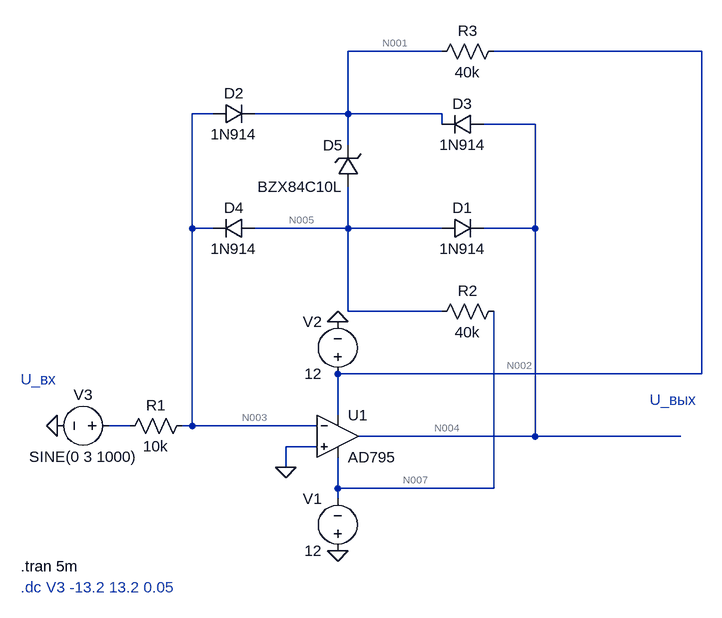
[diagram p0: schematic s3.asc]
s3.asc, the LTspice schematic file:
Version 4.1
SHEET 1 932 680
WIRE 304 -432 160 -432
WIRE 704 -432 384 -432
WIRE -48 -336 -80 -336
WIRE 160 -336 160 -432
WIRE 160 -336 16 -336
WIRE 304 -336 160 -336
WIRE 304 -320 304 -336
WIRE 448 -320 368 -320
WIRE 160 -288 160 -336
WIRE -80 -160 -80 -336
WIRE -48 -160 -80 -160
WIRE 160 -160 160 -224
WIRE 160 -160 16 -160
WIRE 304 -160 160 -160
WIRE 448 -160 448 -320
WIRE 448 -160 368 -160
WIRE 160 -32 160 -160
WIRE 304 -32 160 -32
WIRE 704 64 704 -432
WIRE 704 64 144 64
WIRE 144 128 144 64
WIRE -176 144 -208 144
WIRE -80 144 -80 -160
WIRE -80 144 -96 144
WIRE 112 144 -80 144
WIRE 448 160 448 -160
WIRE 448 160 176 160
WIRE 672 160 448 160
WIRE 112 176 64 176
WIRE 64 208 64 176
WIRE 144 240 144 192
WIRE 384 240 384 -32
WIRE 384 240 144 240
WIRE 144 256 144 240
FLAG 144 -16 0
FLAG 144 336 0
FLAG 64 208 0
FLAG -288 144 0
SYMBOL OpAmps\\AD795 144 96 R0
SYMATTR InstName U1
SYMBOL voltage 144 352 R180
WINDOW 0 24 96 Left 2
WINDOW 3 24 16 Left 2
SYMATTR InstName V1
SYMATTR Value 12
SYMBOL voltage 144 80 R180
WINDOW 0 24 96 Left 2
WINDOW 3 24 16 Left 2
SYMATTR InstName V2
SYMATTR Value 12
SYMBOL res -192 160 R270
WINDOW 0 32 56 VTop 2
WINDOW 3 0 56 VBottom 2
SYMATTR InstName R1
SYMATTR Value 10k
SYMBOL voltage -192 144 R90
WINDOW 0 -32 56 VBottom 2
WINDOW 3 32 56 VTop 2
WINDOW 123 0 0 Left 0
WINDOW 39 0 0 Left 0
SYMATTR InstName V3
SYMATTR Value SINE(0 3 1000)
SYMBOL res 400 -48 R90
WINDOW 0 0 56 VBottom 2
WINDOW 3 32 56 VTop 2
SYMATTR InstName R2
SYMATTR Value 40k
SYMBOL res 400 -448 R90
WINDOW 0 0 56 VBottom 2
WINDOW 3 32 56 VTop 2
SYMATTR InstName R3
SYMATTR Value 40k
SYMBOL diode 304 -144 R270
WINDOW 0 32 32 VTop 2
WINDOW 3 0 32 VBottom 2
SYMATTR InstName D1
SYMATTR Value 1N914
SYMBOL diode -48 -320 R270
WINDOW 0 32 32 VTop 2
WINDOW 3 0 32 VBottom 2
SYMATTR InstName D2
SYMATTR Value 1N914
SYMBOL diode 368 -336 R90
WINDOW 0 0 32 VBottom 2
WINDOW 3 32 32 VTop 2
SYMATTR InstName D3
SYMATTR Value 1N914
SYMBOL diode 16 -176 R90
WINDOW 0 0 32 VBottom 2
WINDOW 3 32 32 VTop 2
SYMATTR InstName D4
SYMATTR Value 1N914
SYMBOL zener 176 -224 R180
WINDOW 0 24 64 Left 2
WINDOW 3 24 0 Left 2
SYMATTR InstName D5
SYMATTR Value BZX84C10L
TEXT 624 104 Left 2 ;U_вых
TEXT -344 72 Left 2 ;U_вх
TEXT -344 360 Left 2 !.tran 5m
TEXT -344 392 Left 2 ;.dc V3 -13.2 13.2 0.05

The netlist it stands for:
* s3.asc
X§U1 0 N003 N002 N007 N004 AD795  ; pins In+ In- V+ V- OUT
V1 0 N007 12
V2 N002 0 12
R1 N006 N003 10k
V3 N006 0 SINE(0 3 1000)
R2 N007 N005 40k
R3 N002 N001 40k
D1 N005 N004 1N914
D2 N003 N001 1N914
D3 N004 N001 1N914
D4 N005 N003 1N914
D5 N005 N001 BZX84C10L
.model D D
.lib standard.dio
* U_вых
* U_вх
.tran 5m
* .dc V3 -13.2 13.2 0.05
.lib ADI1.lib
.backanno
.end

* Results of the author's LTspice run, read from the files saved beside the schematic
* Operating Point, zero values left out:
*   V(n001) = 4.888 V
*   V(n002) = 12 V
*   V(n005) = -4.888 V
*   V(n007) = -12 V
*   I(D1) = -2.525 nA
*   I(D2) = -2.525 nA
*   I(D3) = -2.525 nA
*   I(D4) = -2.525 nA
*   I(D5) = -177.8 µA
*   I(R2) = -177.8 µA
*   I(R3) = 177.8 µA
*   I(V1) = -1.403 mA
*   I(V2) = -1.403 mA
*   Ix(u1:3) = 1.226 mA
*   Ix(u1:4) = -1.226 mA
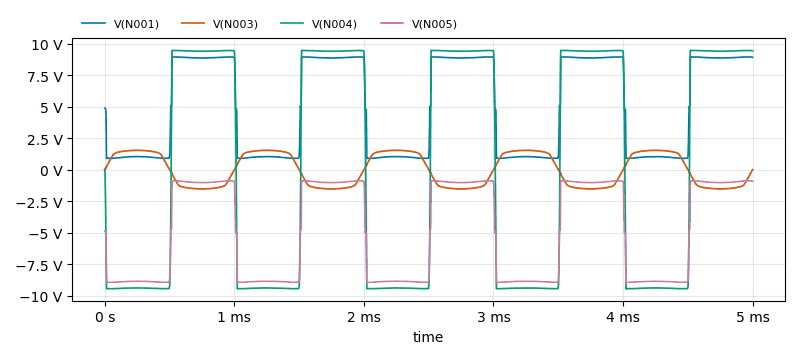
[diagram p1: Transient Analysis of s3.asc, plotted from the saved traces]
* Transient Analysis, 1 run:
*   V(N001): min 890.2 mV, max 8.953 V, average 4.935 V, rms 6.295 V, last 8.91 V
*   V(N003): min -1.526 V, max 1.534 V, average 2.556 mV, rms 1.296 V, last -1.552 mV
*   V(N004): min -9.456 V, max 9.465 V, average -3.318 mV, rms 9.318 V, last 9.422 V
*   V(N005): min -8.944 V, max -881.1 mV, average -4.924 V, rms 6.287 V, last -923.7 mV